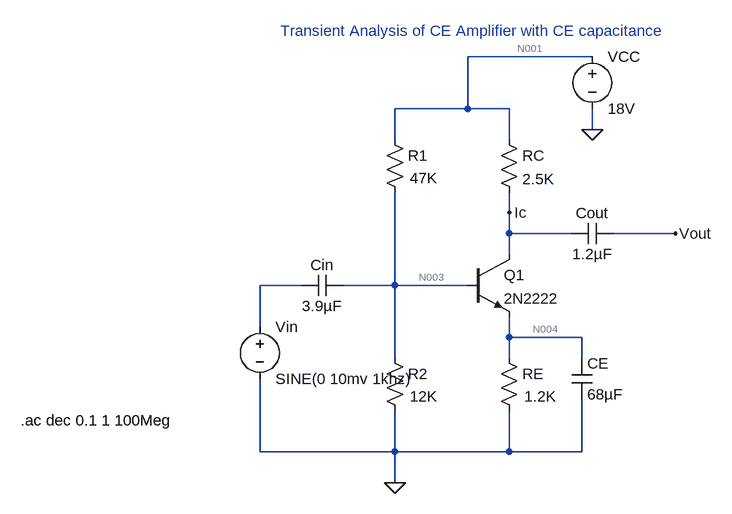
[diagram p0: schematic common_emitter_amplifier.asc]
common_emitter_amplifier.asc, the LTspice schematic file:
Version 4
SHEET 1 1152 680
WIRE 608 0 416 0
WIRE 416 80 416 0
WIRE 416 80 304 80
WIRE 480 80 416 80
WIRE 608 112 608 80
WIRE 304 128 304 80
WIRE 480 128 480 80
WIRE 480 240 480 208
WIRE 480 272 480 240
WIRE 576 272 480 272
WIRE 736 272 640 272
WIRE 480 304 480 272
WIRE 160 352 96 352
WIRE 304 352 304 208
WIRE 304 352 224 352
WIRE 416 352 304 352
WIRE 96 416 96 352
WIRE 480 432 480 400
WIRE 592 432 480 432
WIRE 304 464 304 352
WIRE 480 464 480 432
WIRE 592 464 592 432
WIRE 96 608 96 496
WIRE 304 608 304 544
WIRE 304 608 96 608
WIRE 480 608 480 544
WIRE 480 608 304 608
WIRE 592 608 592 528
WIRE 592 608 480 608
WIRE 304 656 304 608
FLAG 304 656 0
FLAG 480 240 Ic
FLAG 608 112 0
FLAG 736 272 Vout
SYMBOL npn 416 304 R0
SYMATTR InstName Q1
SYMATTR Value 2N2222
SYMBOL res 288 112 R0
WINDOW 3 39 75 Left 2
SYMATTR Value 47K
SYMATTR InstName R1
SYMBOL res 464 112 R0
SYMATTR InstName RC
SYMATTR Value 2.5K
SYMBOL res 288 448 R0
WINDOW 3 39 75 Left 2
SYMATTR Value 12K
SYMATTR InstName R2
SYMBOL res 464 448 R0
WINDOW 3 39 75 Left 2
SYMATTR Value 1.2K
SYMATTR InstName RE
SYMBOL cap 224 336 R90
WINDOW 0 0 32 VBottom 2
WINDOW 3 32 32 VTop 2
SYMATTR InstName Cin
SYMATTR Value 3.9µF
SYMBOL cap 640 256 R90
WINDOW 0 0 32 VBottom 2
WINDOW 3 32 32 VTop 2
SYMATTR InstName Cout
SYMATTR Value 1.2µF
SYMBOL cap 576 464 R0
SYMATTR InstName CE
SYMATTR Value 68µF
SYMBOL voltage 608 -16 R0
SYMATTR InstName VCC
SYMATTR Value 18V
SYMBOL voltage 96 400 R0
SYMATTR InstName Vin
SYMATTR Value SINE(0 10mv 1khz)
SYMATTR Value2 AC 1
TEXT -272 560 Left 2 !.ac dec 0.1 1 100Meg
TEXT 128 -40 Left 2 ;Transient Analysis of CE Amplifier with CE capacitance

The netlist it stands for:
* common_emitter_amplifier.asc
Q1 Ic N003 N004 0 2N2222
R1 N001 N003 47K
RC N001 Ic 2.5K
R2 N003 0 12K
RE N004 0 1.2K
Cin N003 N002 3.9µF
Cout Vout Ic 1.2µF
CE N004 0 68µF
VCC N001 0 18V
Vin N002 0 SINE(0 10mv 1khz) AC 1
.model NPN NPN
.model PNP PNP
.lib standard.bjt
.ac dec 0.1 1 100Meg
* Transient Analysis of CE Amplifier with CE capacitance
.backanno
.end

* Results of the author's LTspice run, read from the files saved beside the schematic
* Operating Point, zero values left out:
*   V(ic) = 12.03 V
*   V(n003) = 3.555 V
*   V(n004) = 2.879 V
*   V(n001) = 18 V
*   V(vout) = 14.44 µV
*   Ic(Q1) = 2.388 mA
*   Ib(Q1) = 11.09 µA
*   Ie(Q1) = -2.399 mA
*   I(R1) = 307.3 µA
*   I(Rc) = 2.388 mA
*   I(R2) = 296.3 µA
*   I(Re) = 2.399 mA
*   I(Vcc) = -2.695 mA
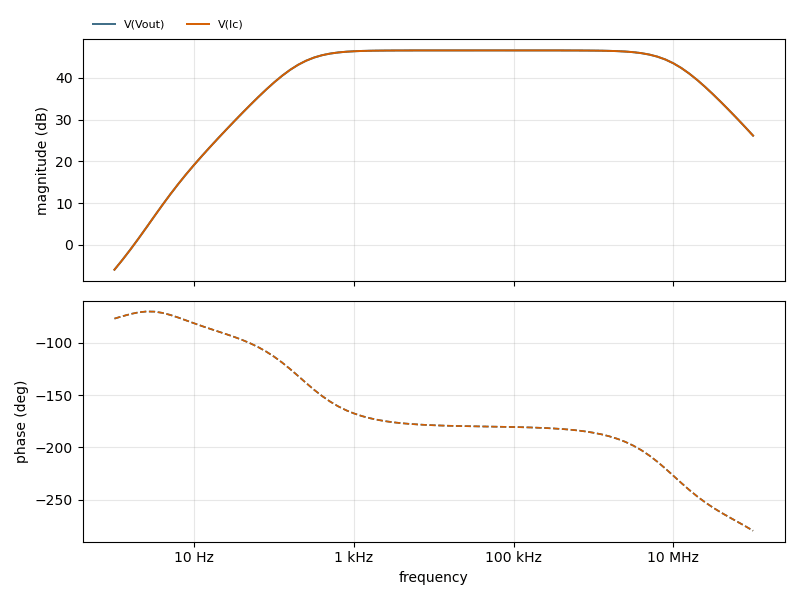
[diagram p1: AC Analysis of common_emitter_amplifier.asc, plotted from the saved traces]
* AC Analysis, 1 run:
*   V(Vout): -5.94 dB at 1 Hz, 26.16 dB at 100 MHz, peak 46.57 dB at 50.12 kHz, 3 dB below the peak at 221.3 Hz and 9.852 MHz
*   V(Ic): -5.94 dB at 1 Hz, 26.16 dB at 100 MHz, peak 46.57 dB at 50.12 kHz, 3 dB below the peak at 221.3 Hz and 9.852 MHz